# Altium schematic sheet Connector_Inverter.SchDoc
size A; SheetNumber: 11; SheetTotal: 15
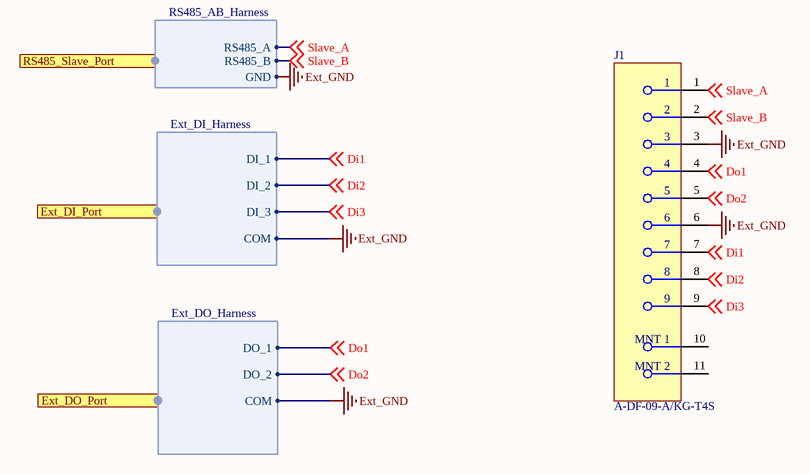
[diagram p0: Connector_Inverter.SchDoc]

## Parts
J1  A-DF-09-A/KG-T4S  [FP-A-DF_09_A-KG-T4S-MFG]

## Ports
Ext_DI_Port (harness Ext_DI_Harness), Ext_DO_Port (harness Ext_DO_Harness), RS485_Slave_Port (harness RS485_AB_Harness)

## Harnesses
RS485_AB_Harness: RS485_A, RS485_B, GND
Ext_DI_Harness: DI_1, DI_2, DI_3, COM
Ext_DO_Harness: DO_1, DO_2, COM

## Nets
Ext_GND: J1.3 J1.6 ; port RS485_Slave_Port.GND, port Ext_DI_Port.COM, port Ext_DO_Port.COM
Di1: J1.7 ; off-sheet Di1, port Ext_DI_Port.DI_1
Di2: J1.8 ; off-sheet Di2, port Ext_DI_Port.DI_2
Di3: J1.9 ; off-sheet Di3, port Ext_DI_Port.DI_3
Do1: J1.4 ; off-sheet Do1, port Ext_DO_Port.DO_1
Do2: J1.5 ; off-sheet Do2, port Ext_DO_Port.DO_2
Slave_A: J1.1 ; off-sheet Slave_A, port RS485_Slave_Port.RS485_A
Slave_B: J1.2 ; off-sheet Slave_B, port RS485_Slave_Port.RS485_B

Not connected (* = marked no-connect by the designer): J1 10(MNT_1) 11(MNT_2)

## Library data of the parts
J1 = CMP-10493-48660751-2: Conn D-Sub F 9 POS 1.38mm Solder RA Thru-Hole 9 Terminal 1 Port; Manufacturer_P/N: A-DF 09 A/KG-T4S; Min Operating Temperature: -55°C; Mount: Through Hole; Digi-Key_Part_Number: AE10924-ND; JLC P/N: C3140260